# EAGLE design Mote_switch (EAGLE 7.2.0)
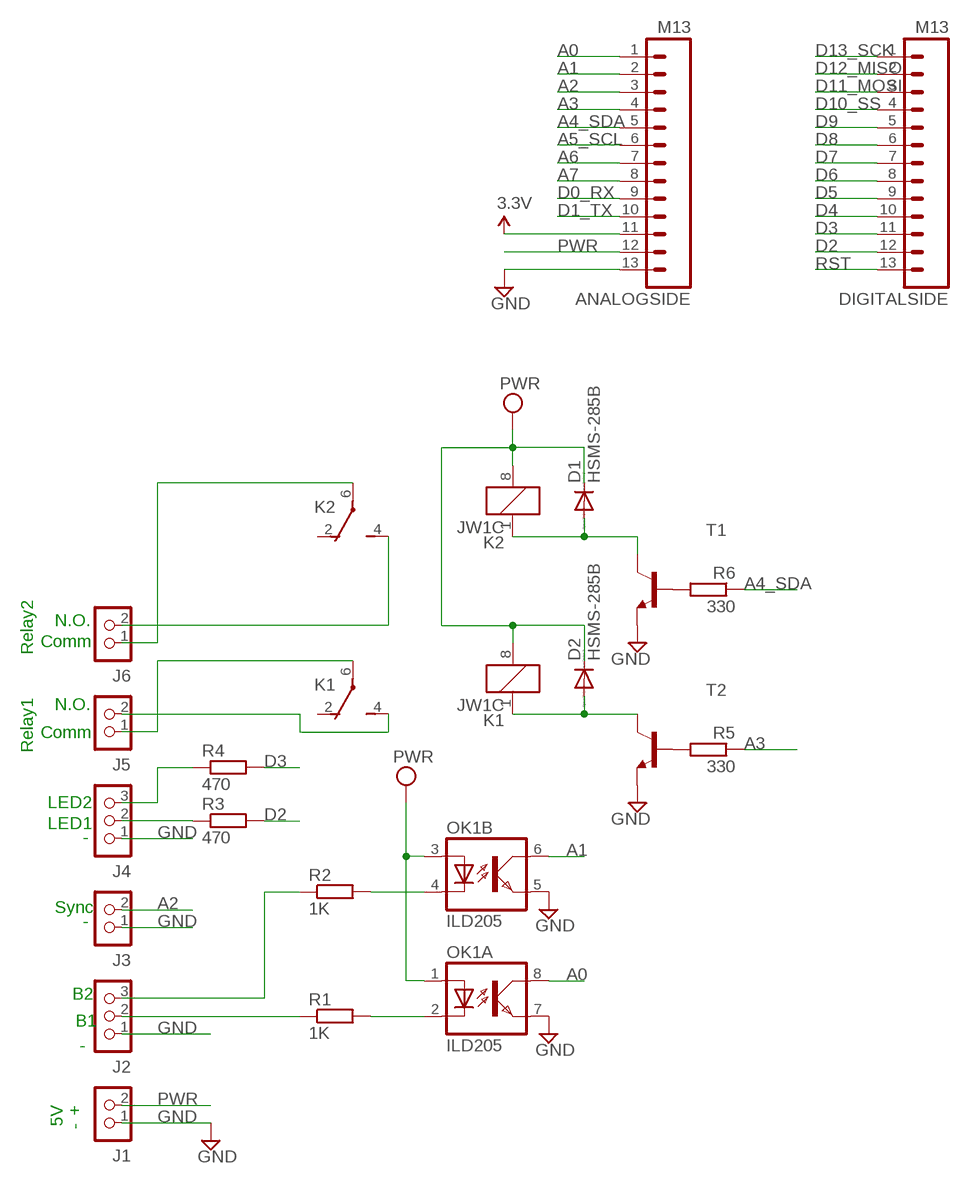
[diagram p0: schematic, sheet 1]

## Parts
ANALOGSIDE  M13  [1X13]
D1  HSMS-285B  [SOT323]
D2  HSMS-285B  [SOT323]
DIGITALSIDE  M13  [1X13]
J1  CON_TERMINAL_BLOCK_02-5MM  [TERMINAL_BLOCK_2P_5]
J2  CON_TERMINAL_BLOCK_03-5MM  [TERMINAL_BLOCK_3P_5]
J3  CON_TERMINAL_BLOCK_02-5MM  [TERMINAL_BLOCK_2P_5]
J4  CON_TERMINAL_BLOCK_03-5MM  [TERMINAL_BLOCK_3P_5]
J5  CON_TERMINAL_BLOCK_02-5MM  [TERMINAL_BLOCK_2P_5]
J6  CON_TERMINAL_BLOCK_02-5MM  [TERMINAL_BLOCK_2P_5]
K1  JW1C  [JW1C]
K2  JW1C  [JW1C]
OK1  ILD205  [SOIC08]
R1  1K  R-EU_M2012  [M2012]
R2  1K  R-EU_M2012  [M2012]
R3  470  R-EU_M2012  [M2012]
R4  470  R-EU_M2012  [M2012]
R5  330  R-EU_M2012  [M2012]
R6  330  R-EU_M2012  [M2012]
T1  MMBT2222ALT1-NPN-SOT23-BEC  [SOT23-BEC]
T2  MMBT2222ALT1-NPN-SOT23-BEC  [SOT23-BEC]

## Nets
A0: ANALOGSIDE.1 OK1.8(A:COL)
A1: ANALOGSIDE.2 OK1.6(B:COL)
A2: ANALOGSIDE.3 J3.2
A3: ANALOGSIDE.4 R5.1
A4_SDA: ANALOGSIDE.5 R6.1
A5_SCL: ANALOGSIDE.6
A6: ANALOGSIDE.7
A7: ANALOGSIDE.8
D0_RX: ANALOGSIDE.9
D1_TX: ANALOGSIDE.10
D2: DIGITALSIDE.12 R3.2
D3: DIGITALSIDE.11 R4.2
D4: DIGITALSIDE.10
D5: DIGITALSIDE.9
D6: DIGITALSIDE.8
D7: DIGITALSIDE.7
D8: DIGITALSIDE.6
D9: DIGITALSIDE.5
D10_SS: DIGITALSIDE.4
D11_MOSI: DIGITALSIDE.3
D12_MISO: DIGITALSIDE.2
D13_SCK: DIGITALSIDE.1
GND [power]: ANALOGSIDE.13 J1.1 J2.1 J3.1 J4.1 OK1.5(B:EMIT) OK1.7(A:EMIT) T1.E T2.E
N$1: J2.2 R1.1
N$2: OK1.2(A:C) R1.2
N$3: J2.3 R2.1
N$4: OK1.4(B:C) R2.2
N$5: R5.2 T2.B
N$6: J4.3 R4.1
N$7: R6.2 T1.B
N$8: J6.2 K2.4(1:S)
N$9: J4.2 R3.1
N$10: D2.1(A) K1.1 T2.C
N$11: D1.1(A) K2.1 T1.C
N$13: J6.1 K2.6(1:P)
N$14: J5.1 K1.6(1:P)
N$15: J5.2 K1.4(1:S)
PWR [power]: ANALOGSIDE.12 J1.2
RST: DIGITALSIDE.13
VCC: ANALOGSIDE.11 D1.3(C) D2.3(C) K1.8 K2.8 OK1.1(A:A) OK1.3(B:A) ; supply symbol labelled 3.3V, PWR
Unconnected: K1.2(1:O) K2.2(1:O)

## Notes on the sheet
- N.O.
- Comm
- Relay2
- N.O.
- Comm
- Relay1
- LED2
- LED1
- -
- Sync
- -
- B2
- B1
- -
- 5V | +
- -

## Library data of the parts
ANALOGSIDE DIGITALSIDE = SparkFun-Connectors:M13: 13-pin single row .1" header
D1 D2 = avago:HSMS-285B: Surface Mount Microwave Schottky Detector Diodes Source: Data sheet <http://www.farnell.com/datasheets/461166.pdf>
J1 J3 J5 J6 = dp_devices:CON_TERMINAL_BLOCK_02: 2 poles wire to board terminal block
J2 J4 = dp_devices:CON_TERMINAL_BLOCK_03: 3 poles, wire to board connector
K1 K2 = relay:JW1C: Power relay Source: Panasonic Electric Works Co., Ltd. / jw.catalog.pdf
OK1 = optocoupler:ILD2*: Siemens ILD205/206/207/211/213/217 DUAL PHOTOTRANSISTOR SMALL OUTLINE SURFACE MOUNT OPTOCOUPLER Source: 153385-da-01-en-Optocoupler_ILD205-T.pdf; MF: VISHAY/TELEFUNKEN; MPN: ILD205T; OC_FARNELL: 1469512; OC_NEWARK: 20H8678
R1-R6 = resistor:R-EU_: RESISTOR, European symbol
T1 T2 = transistor:*-NPN-: NPN Transistror BF959 corrected 2008.03.06

## Net classes
1 power: width 0.381 mm, clearance 0.254 mm

## Board
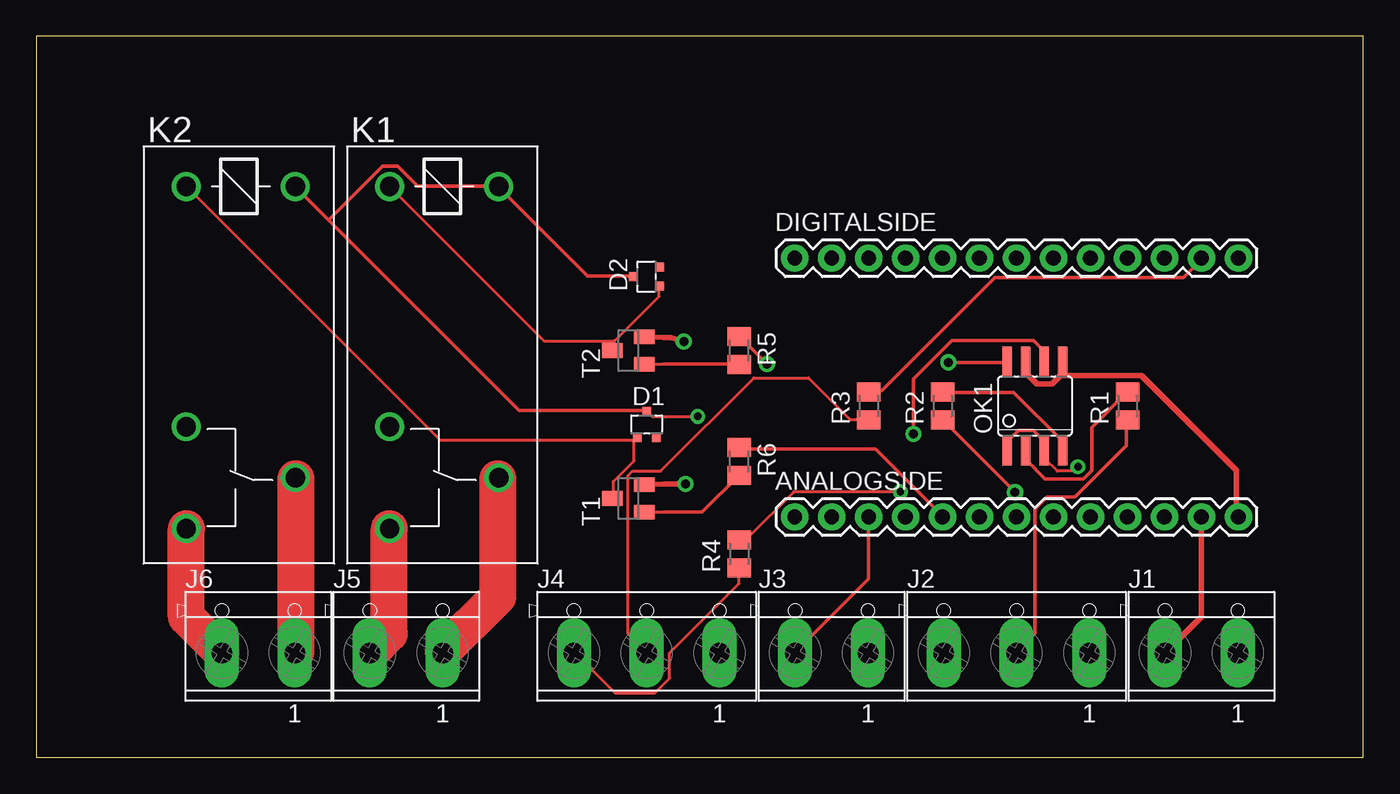
[diagram p1: board, top side]
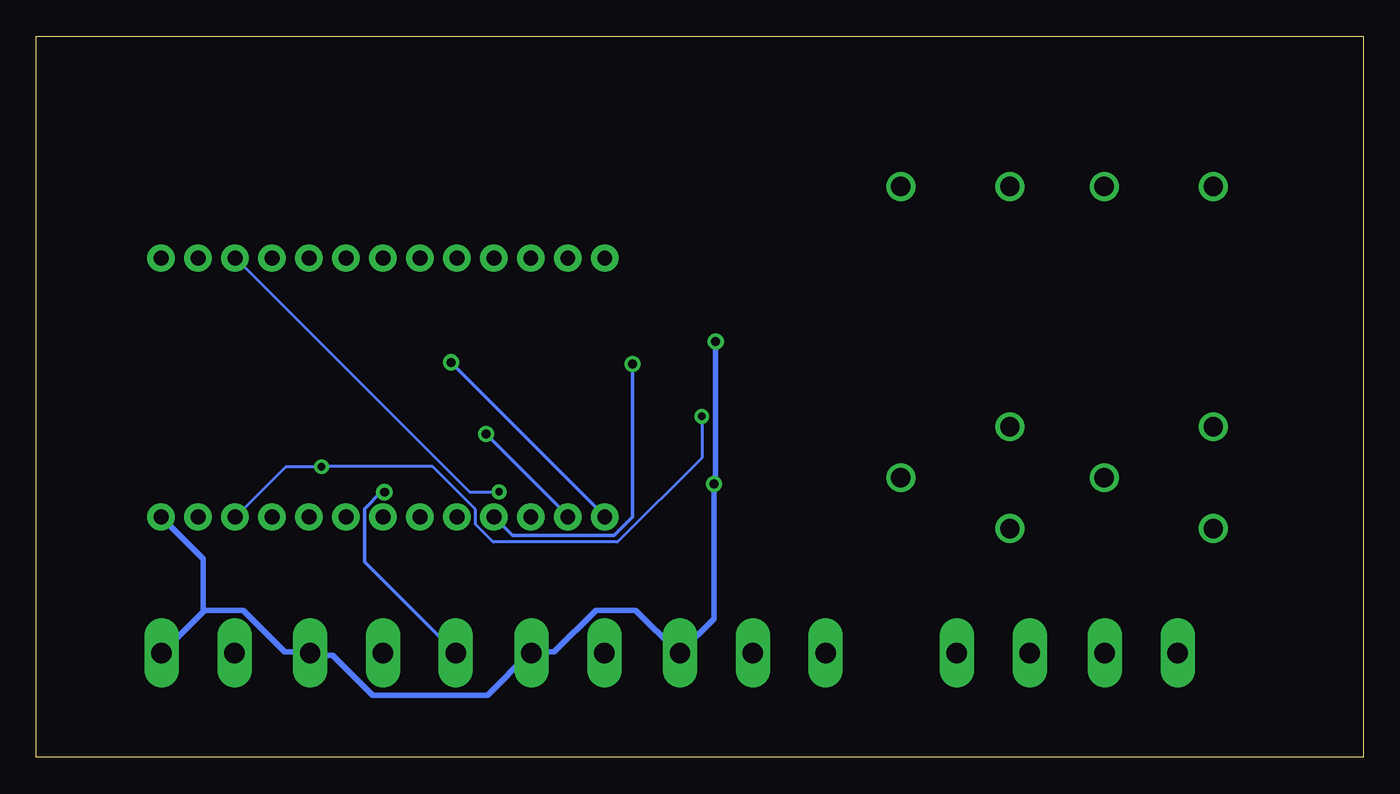
[diagram p2: board, bottom side, seen from below]

Size 91.11 x 49.52 mm. Coordinates in mm from the lower left corner, seen from the top.
Outline: 0,0 91.11,0 91.11,49.52 0,49.52 0,0
Copper layers (1*16): Top 0.035mm / dielectric 1.5mm / Bottom 0.035mm
Design rules "SparkFun": minimum track width 8mil, minimum drill 20mil, track to track 8mil, track to pad 8mil, pad to pad 8mil, via to via 8mil, smd to smd 8mil, copper to edge 10mil, drill to drill 8mil, minimum pad ring 12mil, minimum via ring 10mil, stop-mask expansion 4mil, vias tented up to drill 25mil, thermal gap 10mil

### Footprints (pad centres in the part's own frame; a part is rotated, then mirrored left to right if it is on the bottom)
1X13 = drill 1.016 pad 1.88: 1 0,0; 2 2.54,0; 3 5.08,0; 4 7.62,0; 5 10.16,0; 6 12.7,0; 7 15.24,0; 8 17.78,0; 9 20.32,0; 10 22.86,0; 11 25.4,0; 12 27.94,0; 13 30.48,0
SOT323 = smd 0.6 x 0.55: 1 -0.65,-0.925; 2 0.65,-0.925; 3 0,0.925
TERMINAL_BLOCK_2P_5 = drill 1.4 pad 2.38 long: 1 2.5,-0.45; 2 -2.5,-0.45
TERMINAL_BLOCK_3P_5 = drill 1.4 pad 2.38 long: 1 5,-0.45; 2 0,-0.45; 3 -5,-0.45
JW1C = drill 1.321 pad 1.9: 1 -10,-3.683; 2 6.5,-3.683; 4 13.5,-3.683; 6 10,3.81; 8 -10,3.81
SOIC08 = smd 0.66 x 2.032: 1 -1.905,-3.073; 2 -0.635,-3.073; 3 0.635,-3.073; 4 1.905,-3.073; 5 1.905,3.073; 6 0.635,3.073; 7 -0.635,3.073; 8 -1.905,3.073
M2012 = smd 1.3 x 1.6: 1 -0.95,0; 2 0.95,0
SOT23-BEC = smd 1 x 1.4: B -0.95,-1.1; C 0,1.1; E 0.95,-1.1

### Placement (x,y rotation side)
ANALOGSIDE  52.07,16.51 0 top
D1  41.91,22.86 0 top
D2  41.91,33.02 90 top
DIGITALSIDE  52.07,34.29 0 top
J1  80.01,7.62 0 top
J2  67.31,7.62 0 top
J3  54.61,7.62 0 top
J4  41.91,7.62 0 top
J5  25.4,7.62 0 top
J6  15.24,7.62 0 top
K1  27.94,29.21 270 top
K2  13.97,29.21 270 top
OK1  68.58,24.13 0 top
R1  74.93,24.13 90 top
R2  62.23,24.13 90 top
R3  57.15,24.13 90 top
R4  48.26,13.97 90 top
R5  48.26,27.94 270 top
R6  48.26,20.32 270 top
T1  40.64,17.78 90 top
T2  40.64,27.94 90 top

### Tracks (layer width: path | path; a pad name or v marks a point on that pad's centre or on a via)
A0  (via drill 0.61)
  Top 0.254: v62.64,27.13 66.64,27.13 OK1.8
  Bottom 0.254: v62.64,27.13 52.12,16.61 ANALOGSIDE.1
A1  (via drill 0.61)
  Top 0.254: v60.24,22.21 60.24,25.98 62.87,28.61 68.47,28.61 69.15,27.93 69.15,27.24 OK1.6
  Bottom 0.254: v60.24,22.21 54.63,16.61 ANALOGSIDE.2
A2
  Top 0.254: ANALOGSIDE.3 57.15,12.27 52.12,7.24 J3.2
A3  (via drill 0.61)
  Top 0.203: R5.1 48.26,28.9 48.35,28.84
  Top 0.254: v50.18,27.01 48.35,28.84
  Bottom 0.254: v50.18,27.01 50.18,16.5 51.44,15.24 58.41,15.24 59.66,16.5 ANALOGSIDE.4
A4_SDA
  Top 0.254: R6.1 48.35,21.18 57.61,21.18 62.18,16.61 ANALOGSIDE.5
D2
  Top 0.254: R3.2 57.15,25.18 58.06,25.18 65.84,32.96 78.75,32.96 80.01,34.21 DIGITALSIDE.12
D3  (via drill 0.51)
  Top 0.203: v59.33,18.24 52.02,18.24 48.77,14.99 48.26,14.99 R4.2
  Bottom 0.203: v59.33,18.24 61.37,18.24 77.42,34.29 DIGITALSIDE.11
GND  (via drill 0.61)
  Top 0.381: OK1.7 68.01,27.13 68.01,26.33 68.69,25.64 69.72,25.64 70.41,26.33 70.41,27.13 OK1.5 | 70.64,27.24 OK1.5 | 82.53,16.61 ANALOGSIDE.13 82.41,16.73 82.41,19.7 75.89,26.21 70.52,26.21 OK1.5 | v44.58,18.78 43.09,18.78 T1.E | v44.46,28.56 43.55,28.84 43.09,28.84 T2.E
  Bottom 0.381: 79.55,10.1 76.92,10.1 74.07,7.24 72.35,7.24 J2.1 72.24,7.01 70.75,7.01 68.01,4.27 60.12,4.27 57.26,7.12 J3.1 57.04,7.24 55.55,7.24 52.69,10.1 49.95,10.1 47.09,7.24 J4.1 46.86,7.24 44.58,9.53 v44.58,18.78 44.46,18.9 v44.46,28.56 | 79.55,10.1 82.41,7.24 J1.1 | 79.55,10.1 79.67,10.21 79.67,13.64 82.53,16.5 ANALOGSIDE.13
N$1
  Top 0.254: J2.2 67.32,7.24 68.58,8.5 68.58,17.07 69.38,17.87 71.32,17.87 74.87,21.41 74.87,23.13 R1.1
N$2
  Top 0.254: R1.2 74.87,25.07 72.47,22.67 72.47,19.7 71.89,19.13 69.27,19.13 68.01,20.38 68.01,20.95 OK1.2
N$3  (via drill 0.61)
  Top 0.254: v67.21,18.21 62.29,23.13 R2.1
  Bottom 0.254: v67.21,18.21 67.44,18.21 68.58,17.07 68.58,13.41 62.41,7.24 J2.3
N$4
  Top 0.254: R2.2 62.29,25.07 67.09,25.07 70.41,21.75 70.41,21.07 OK1.4
N$5
  Top 0.254: T2.B 43.09,27.01 48.23,27.01 R5.2
N$6
  Top 0.203: R4.1 48.26,11.94 43.48,7.16 43.48,5.44 42.47,4.42 39.73,4.42 36.98,7.16 J4.3
N$7
  Top 0.254: T1.B 43.09,16.84 45.72,16.84 48.23,19.36 R6.2
N$8
  Top 0.254: 12.69,7.24 J6.2
  Top 2.54: K2.4 10.29,9.64 12.69,7.24
N$9
  Top 0.203: R3.1 57.1,23.22 55.88,23.22 53.03,26.06 49.28,26.06 42.88,19.66 40.95,19.66 40.64,19.36 40.64,8.48 41.86,7.26 J4.2
N$10
  Top 0.203: 39.67,28.55 39.62,28.5 39.62,27.99 T2.C | 39.67,28.55 42.77,31.65 42.77,32.36 D2.1 | 39.67,28.55 39.62,28.6 34.85,28.6 24.28,39.17 K1.1
N$11
  Top 0.203: 41.05,21.79 41.05,20.37 39.62,18.95 39.62,17.83 T1.C | 41.05,21.79 D1.1 | 41.05,21.79 27.74,21.79 10.36,39.17 K2.1
  Top 0.254: 41.15,21.87 D1.1
N$13
  Top 0.254: 17.83,19.13 K2.6 | 17.83,7.24 J6.1
  Top 2.54: 17.83,7.24 17.83,19.13
N$14
  Top 0.203: 31.7,19.15 K1.6 | 27.94,7.26 J5.1
  Top 2.54: 31.7,19.15 31.7,11.02 27.94,7.26
N$15
  Top 0.254: 24.23,15.7 K1.4 | 22.97,7.24 J5.2
  Top 2.54: 24.23,15.7 24.23,8.5 22.97,7.24
PWR
  Top 0.381: ANALOGSIDE.12 80.01,9.64 77.61,7.24 J1.2
VCC  (via drill 0.51)
  Top 0.203: v71.53,19.96 71.22,19.66 70.1,19.66 69.29,20.47 69.29,20.98 OK1.3 | v45.41,23.42 42.27,23.42 41.96,23.72 D1.3
  Top 0.254: OK1.1 66.75,21.07 66.75,21.75 67.44,22.44 68.47,22.44 69.15,21.75 69.15,21.07 OK1.3 | D2.3 40.92,33.07 37.83,33.07 31.77,39.13 K1.8 31.66,39.24 26.18,39.24 24.8,40.62 23.77,40.62 20.06,36.9 | 20.06,36.9 17.83,39.13 K2.8 | 20.06,36.9 33.15,23.81 41.83,23.81 D1.3
  Bottom 0.203: ANALOGSIDE.11 77.42,16.51 73.97,19.96 v71.53,19.96 63.91,19.96 60.96,17.02 60.96,16 59.74,14.78 51.21,14.78 45.41,20.57 v45.41,23.42